# Altium schematic sheet STM32F103_DEBUG.SchDoc
size A; SheetNumber: 3; SheetTotal: 11
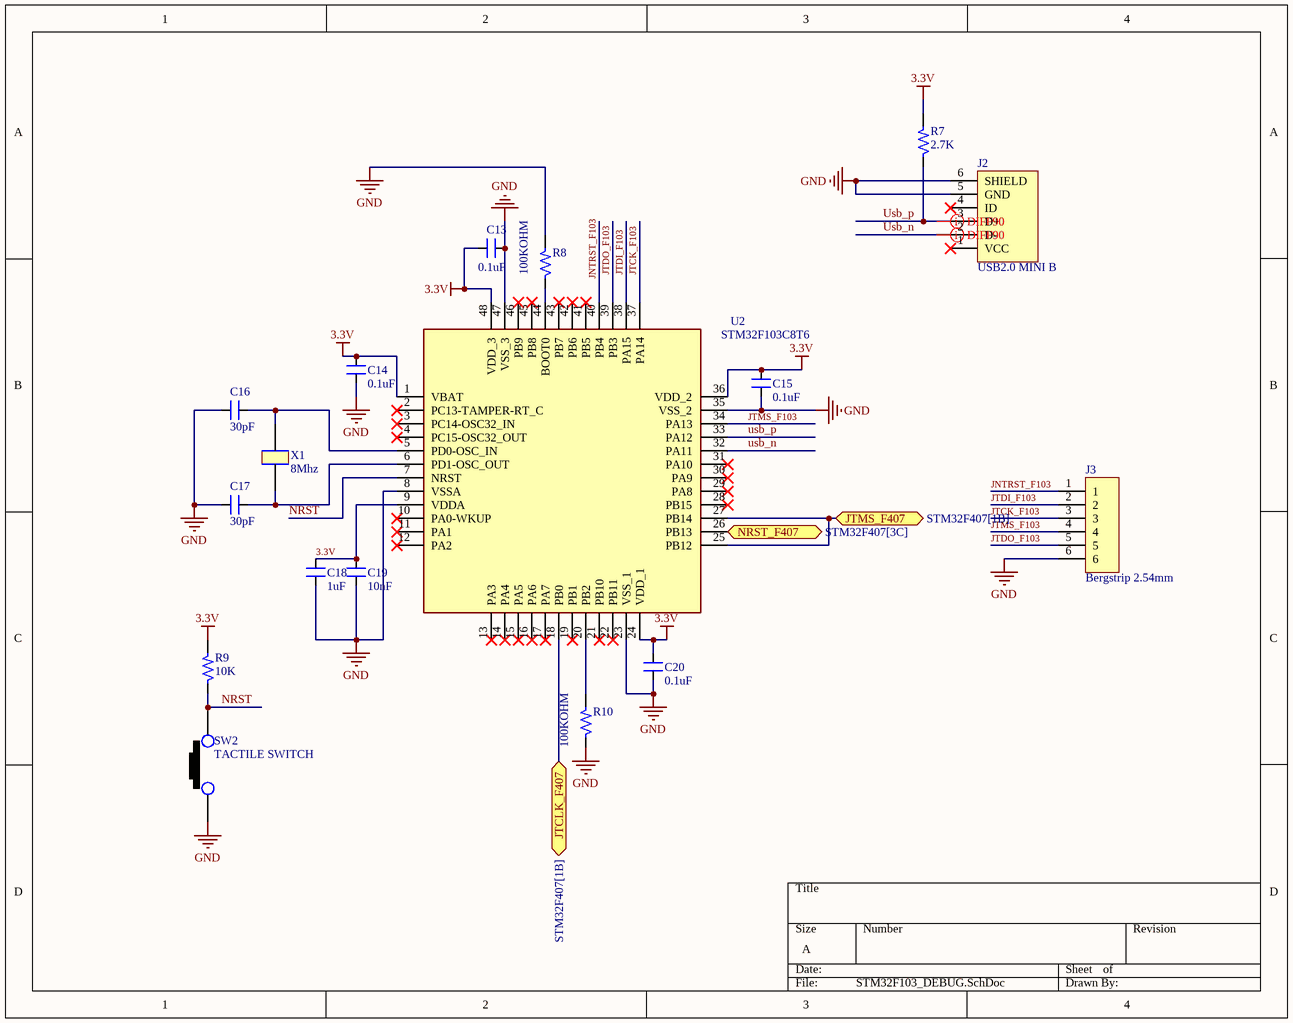
[diagram p0: STM32F103_DEBUG.SchDoc]

## Parts
C13  0.1uF  [CAP_0805]
C14  0.1uF  [CAP_0805]
C15  0.1uF  [CAP_0805]
C16  30pF  [CAP_0805]
C17  30pF  [CAP_0805]
C18  1uF  [CAP_0805]
C19  10nF  [CAP_0805]
C20  0.1uF  [CAP_0805]
J2  USB2.0 MINI B  [CON_690-005-299-043]
J3  Bergstrip 2.54mm  [CON6_100_59D78_TH_ST]
R7  2.7K  [RES_0805]
R8  100KOHM  [RES_2512]
R9  10K  [RES_0603]
R10  100KOHM  [RES_2512]
SW2  TACTILE SWITCH  [SW_342_SMD]
U2  STM32F103C8T6  [LQFP-48_19.6_393_58X11_SMD]
X1  8Mhz  [XTAL_314_240X47_SMD]

## Ports
JTCLK_F407 (bidir, see STM32F407[1B]), JTMS_F407 (bidir, see STM32F407[1B]), NRST_F407 (bidir, see STM32F407[3C])

## Nets
3.3V: C13.2 C14.2 C15.2 C18.2 C19.2 C20.2 R7.2 R9.2 U2.1(VBAT) U2.9(VDDA) U2.24(VDD_1) U2.36(VDD_2) U2.48(VDD_3)
GND: C13.1 C14.1 C15.1 C16.1 C17.1 C18.1 C19.1 C20.1 J2.5(GND) J2.6(SHIELD) J3.6 R8.2 R10.1 SW2.1 U2.8(VSSA) U2.23(VSS_1) U2.35(VSS_2) U2.47(VSS_3)
JNTRST_F103: J3.1 U2.40(PB4)
JTCK_F103: J3.3 U2.37(PA14)
JTCLK_F407: U2.18(PB0) ; port JTCLK_F407
JTDI_F103: J3.2 U2.38(PA15)
JTDO_F103: J3.5 U2.39(PB3)
JTMS_F103: J3.4 U2.34(PA13)
JTMS_F407: U2.25(PB12) U2.27(PB14) ; port JTMS_F407
NRST: R9.1 SW2.2 U2.7(NRST)
NRST_F407: U2.26(PB13) ; port NRST_F407
Usb_n: J2.2(D-) U2.32(PA11)
Usb_p: J2.3(D+) R7.1 U2.33(PA12)
NetC16_2: C16.2 U2.5(PD0-OSC_IN) X1.2
NetC17_2: C17.2 U2.6(PD1-OSC_OUT) X1.1
NetR8_1: R8.1 U2.44(BOOT0)
NetR10_2: R10.2 U2.20(PB2)

Not connected (* = marked no-connect by the designer): J2 1(VCC)* 4(ID)*; U2 2(PC13-TAMPER-RT_C)* 3(PC14-OSC32_IN)* 4(PC15-OSC32_OUT)* 10(PA0-WKUP)* 11(PA1)* 12(PA2)* 13(PA3)* 14(PA4)* 15(PA5)* 16(PA6)* 17(PA7)* 19(PB1)* 21(PB10)* 22(PB11)* 28(PB15)* 29(PA8)* 30(PA9)* 31(PA10)* 41(PB5)* 42(PB6)* 43(PB7)* 45(PB8)* 46(PB9)*

## Layout directives
differential pair; differential pair class *DIFF90: Usb_n, Usb_p

## Library data of the parts
C13-C15 = CAP_0.1uF-50V-20%-0805: 0.1µF ±20% 50V Ceramic Capacitor X7R 0805 (2012 Metric); Manufacturer: Samsung Electro-Mechanics; Manufacturer Part Number: CL21B104MBCNNNC; Alternate Part Number-1: NA; Case/Package: 0805; Supplier-1: SIRICOM; Supplier Part Number-1: 0805B104K500CT
C16 C17 = CAP_30pF-50V-10%-0805: ±10% 50V Ceramic Capacitor C0G, NP0 0805 (2012 Metric); Manufacturer Part Number: C0805C300K5GAC7800; Manufacturer: KEMET; Alternate Part Number: NA; Case/Package: 0805; Supplier-1: Digikey; Supplier Part Number-1: 399-17443-1-ND - Cut Tape (CT)
C18 = CAP_1uF-50V-5%-0805: 1µF ±5% 50V Ceramic Capacitor X7R 0805 (2012 Metric); Manufacturer: Samsung; Manufacturer Part Number: CC0805JKX7R9BB105; Alternate Part Number-1: 0805F105M500NT; Case/Package: 0805; Supplier-1: SIRICOM; Supplier Part Number-1: CL21B105KBFNNNE
C19 = CAP_10nF-50V-10%-0805: 10000pF ±10% 50V Ceramic Capacitor X7R 0805 (2012 Metric); Manufacturer: Samsung; Manufacturer Part Number: C0805C103K5RECAUTO; Alternate Part Number-1: GRM2195C1H103JA01D; Case/Package: 0805; Supplier-1: SIRICOM; Supplier Part Number-1: 0805B103K500CT
C20 = CAP_0.1uF-50V-5%-0805: 0.1µF ±5% 50V Ceramic Capacitor X7R 0805 (2012 Metric); Manufacturer: AVX Corporation; Manufacturer Part Number: 08055C104JAT4A; Alternate Part Number-1: 0805B104M500; Case/Package: 0805; Supplier-1: SIRICOM; Supplier Part Number-1: 0805B104J500CT
J2 = CON_USB2.0-MINIB-SMD: USB - mini B USB 2.0 Receptacle Connector 5 Position Surface Mount, Right Angle; Manufacturer: EDAC; Manufacturer Part Number: 690-005-299-043; Alternate Part Number-1: NA; Case/Package: USB-MINI-B; Supplier-1: LCSC; Supplier Part Number-1: C105424
J3 = CON-BS-SKT_6X1-100-ST-TH: 6 Pins, 1 Row 2.54mm Pitch, Straight bergstrip, Female; Manufacturer: Molex; Alternate Part Number-1: NA; Manufacturer Part Number: 22-10-2061; Case/Package: TH-CON; Supplier-1: SP ROAD; Supplier Part Number-1: NA
R7 = RES_2.7K-0.125W-1%-0805: 2.7 kOhms ±1% 0.125W, 1/8W Chip Resistor 0805 (2012 Metric) Thick Film; Manufacturer: Stackpole Electronics; Manufacturer Part Number: 1623181-1; Alternate Part Number-1: NA; Case/Package: 0805; Supplier-1: SIRICOM; Supplier Part Number-1: WR08X2701FTL
R8 R10 = RES_100mOHM-1W-5%-2512: 100 mOhms ±5% 1W Chip Resistor 2512 (6432 Metric) High Voltage, Non-Magnetic Thick Film; Manufacturer: CTS Resistor Products; Manufacturer Part Number: 73L7R10J; Alternate Part Number-1: CR2512J0R12E04; Case/Package: 2512; Supplier-1: SP ROAD; Supplier Part Number-1: NA
R9 = RES_10K-0.1W-1%-0603: 10 kOhms ±1% 0.1W, 1/10W Chip Resistor 0603 (1608 Metric) Automotive AEC-Q200 Thick Film; Manufacturer: Walsin; Manufacturer Part Number: WR06X1002FTL; Alternate Part Number-1: 0603WAJ0103T5E; Case/Package: 0603; Supplier-1: SIRICOM; Supplier Part Number-1: WR06X1002FTL
SW2 = SW1_RS-282G05A3-SMRT-SMD: Tactile Switch SPST-NO Top Actuated Surface Mount; Manufacturer: ITT C&K; Alternate Part Number-1: NA; Manufacturer Part Number: RS-282G05A3-SMRT; Case/Package: SMD; Supplier-1: SP ROAD; Supplier Part Number-1: RS-282G05A3-SMRT
U2 = IC_STM32F103C8T6: ARM® Cortex®-M3 STM32F1 Microcontroller IC 32-Bit 72MHz 64KB (64K x 8) FLASH 48-LQFP (7x7); Manufacturer: STMicroelectronics; Alternate Part Number-1: NA; Manufacturer Part Number: STM32F103C8T6; Case/Package: LQFP48; Supplier-1: LCSC; Supplier Part Number-1: STM32F103C8T6
X1 = XTAL_8MHZ-ECS-80-32-5PX-SMD: 8MHz ±30ppm Crystal 32pF 60 Ohms HC-49/US; Manufacturer: Fox Electronics; Manufacturer Part Number: ECS-80-32-5PX-TR; Alternate Part Number-1: NA; Case/Package: SMD/SMT; Supplier-1: SP ROAD; Supplier Part Number-1: ECS-80-32-5PX-TR